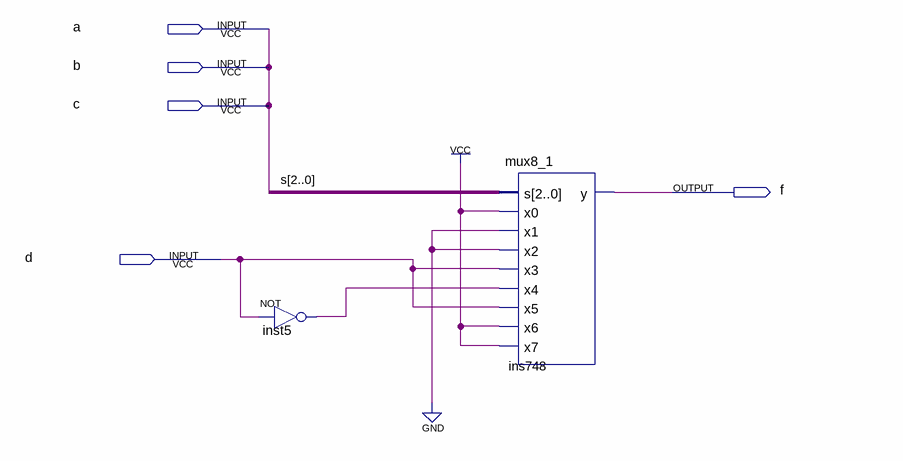
[diagram p0: schematic sheet]
// Quartus schematic muxfinal.bdf as structural Verilog: 2 symbols, 5 pins
module muxfinal (
  input  a,
  input  b,
  input  c,
  input  d,
  output f
);

  wire inst5_out;
  wire [2:0] s;

  not inst5 (inst5_out, d);
  mux8_1 ins748 (.s(s), .x0(1'b1), .x1(1'b0), .x2(1'b0), .x3(d), .x4(inst5_out), .x5(d), .x6(1'b1), .x7(1'b1), .y(f));

  assign b = a;
  assign c = a;
endmodule
